# Altium project Flashing LED Badge.PrjPcb
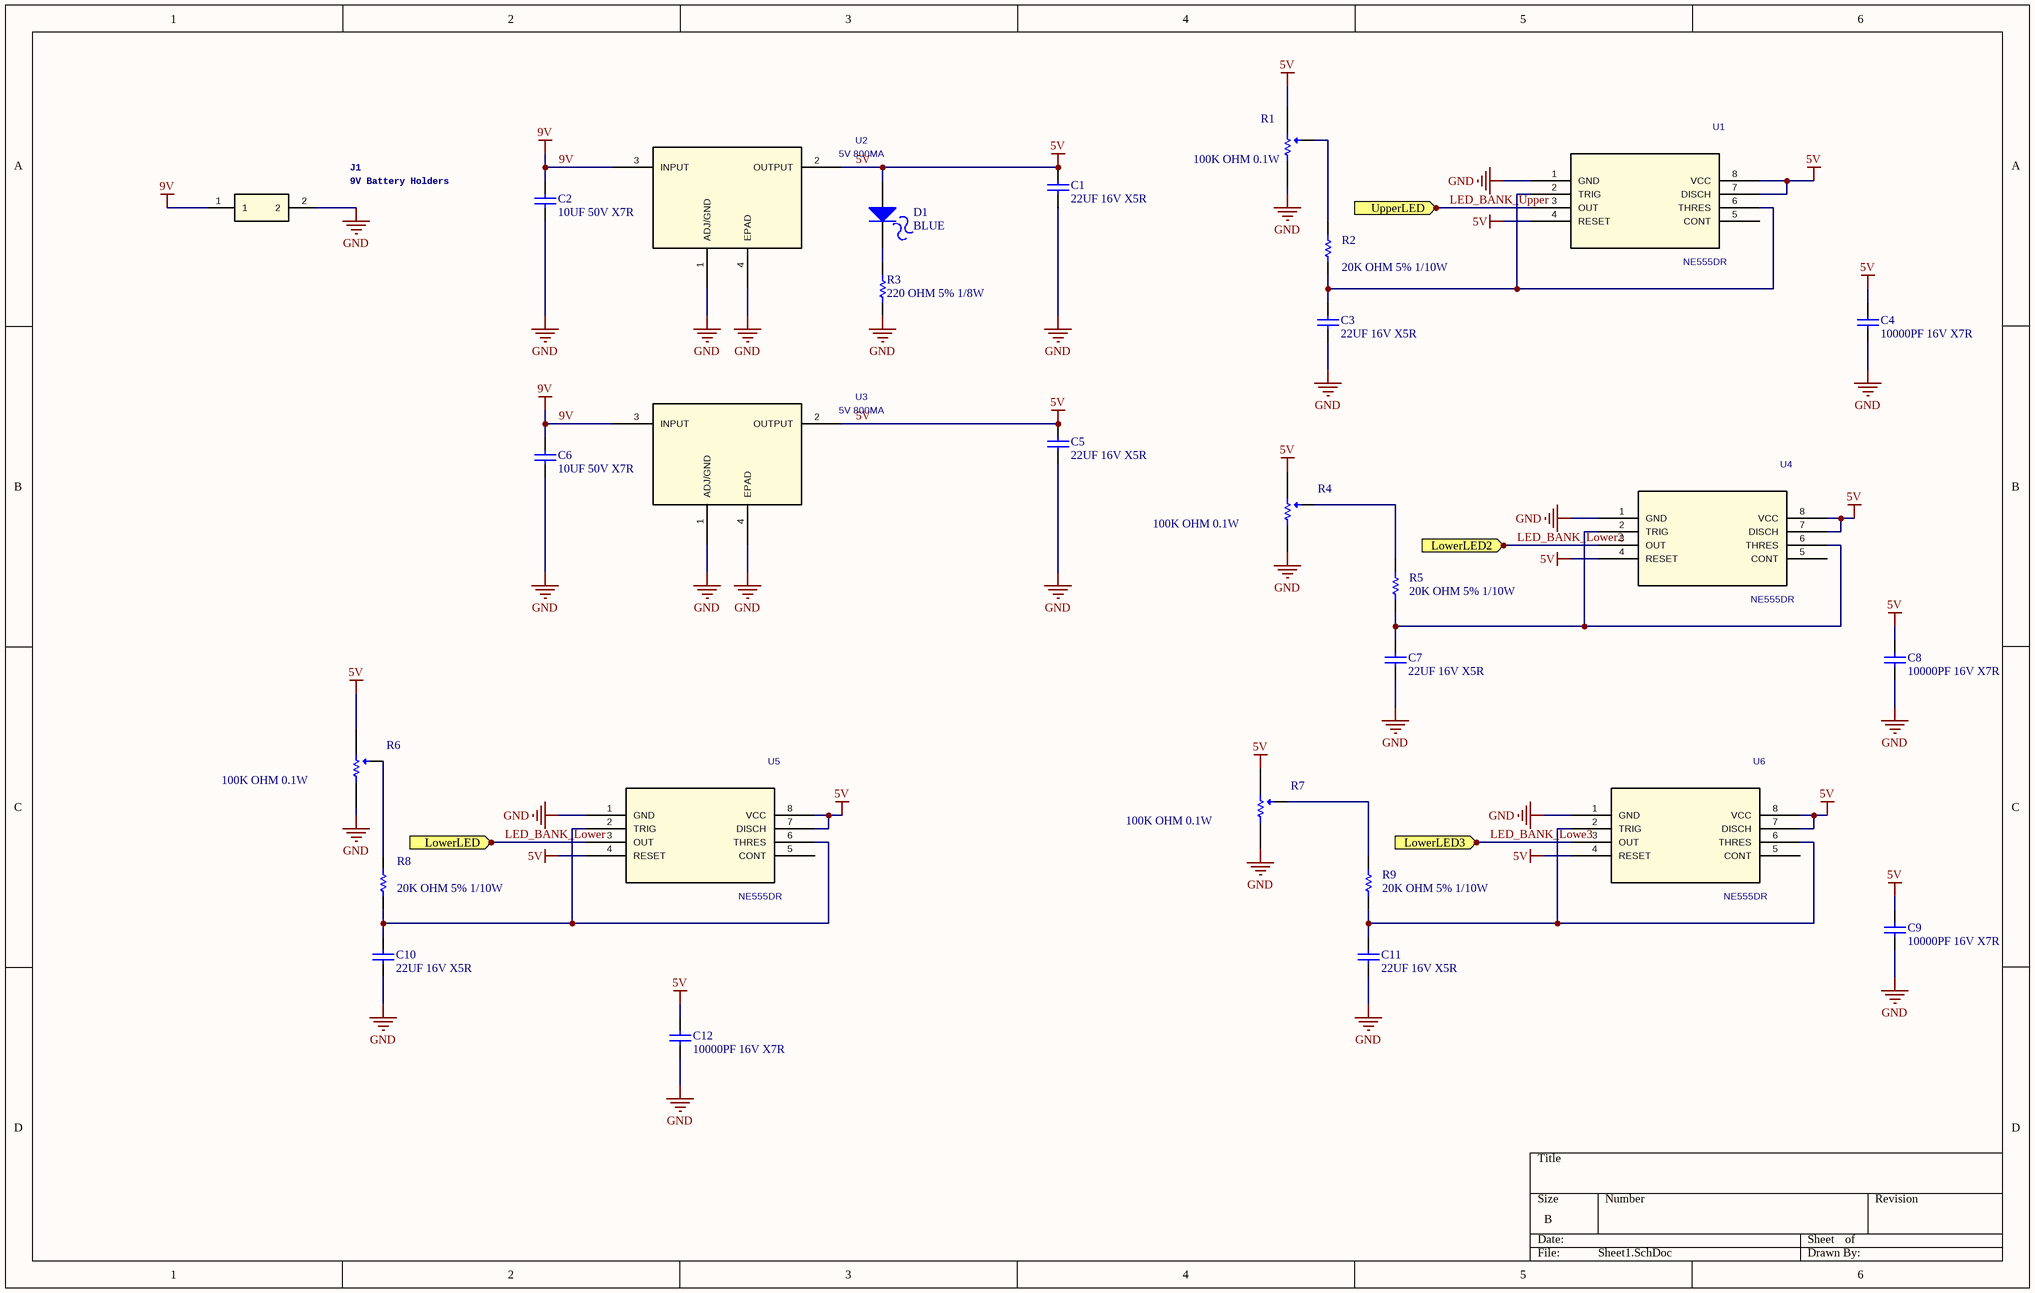
[diagram p0: Sheet1.SchDoc]
2 sheets, 101 parts. Net scope: flat (ports and power ports of the same name join across sheets).
Sheets:
  Sheet1.SchDoc
  Sheet2.SchDoc

## Sheet Sheet1.SchDoc
size B

### Parts
C1  22UF 16V X5R  [SMD-0805C]
C2  10UF 50V X7R  [2220 cap]
C3  22UF 16V X5R  [SMD-0805C]
C4  10000PF 16V X7R  [SMD-0603C]
C5  22UF 16V X5R  [SMD-0805C]
C6  10UF 50V X7R  [2220 cap]
C7  22UF 16V X5R  [SMD-0805C]
C8  10000PF 16V X7R  [SMD-0603C]
C9  10000PF 16V X7R  [SMD-0603C]
C10  22UF 16V X5R  [SMD-0805C]
C11  22UF 16V X5R  [SMD-0805C]
C12  10000PF 16V X7R  [SMD-0603C]
D1  BLUE  [0603 LED BLUE]
J1  9V Battery Holders  [1294]
R1  100K OHM 0.1W  [3.80mm x 3.60mm x 1.20mm POT]
R2  20K OHM 5% 1/10W  [SMD-0603-RES]
R3  220 OHM 5% 1/8W  [SMD-0805-RES]
R4  100K OHM 0.1W  [3.80mm x 3.60mm x 1.20mm POT]
R5  20K OHM 5% 1/10W  [SMD-0603-RES]
R6  100K OHM 0.1W  [3.80mm x 3.60mm x 1.20mm POT]
R7  100K OHM 0.1W  [3.80mm x 3.60mm x 1.20mm POT]
R8  20K OHM 5% 1/10W  [SMD-0603-RES]
R9  20K OHM 5% 1/10W  [SMD-0603-RES]
U1  NE555DR  [SOIC 8 TI]
U2  5V 800MA  [SOT-223]
U3  5V 800MA  [SOT-223]
U4  NE555DR  [SOIC 8 TI]
U5  NE555DR  [SOIC 8 TI]
U6  NE555DR  [SOIC 8 TI]

### Ports
LowerLED, LowerLED2, LowerLED3, UpperLED

### Nets
5V: C1.2 C4.2 C5.2 C8.2 C9.2 C12.2 D1.1(Anode) R1.3 R4.3 R6.3 R7.3 U1.4(RESET) U1.7(DISCH) U1.8(VCC) U2.2(OUTPUT) U3.2(OUTPUT) U4.4(RESET) U4.7(DISCH) U4.8(VCC) U5.4(RESET) U5.7(DISCH) U5.8(VCC) U6.4(RESET) U6.7(DISCH) U6.8(VCC)
9V: C2.2 C6.2 J1.1 U2.3(INPUT) U3.3(INPUT)
GND: C1.1 C2.1 C3.1 C4.1 C5.1 C6.1 C7.1 C8.1 C9.1 C10.1 C11.1 C12.1 J1.2 R1.1 R3.1 R4.1 R6.1 R7.1 U1.1(GND) U2.1(ADJ/GND) U2.4(EPAD) U3.1(ADJ/GND) U3.4(EPAD) U4.1(GND) U5.1(GND) U6.1(GND)
LED_BANK_Lowe3: U6.3(OUT) ; port LowerLED3
LED_BANK_Lower: U5.3(OUT) ; port LowerLED
LED_BANK_Lower2: U4.3(OUT) ; port LowerLED2
LED_BANK_Upper: U1.3(OUT) ; port UpperLED
NetC3_2: C3.2 R2.1 U1.2(TRIG) U1.6(THRES)
NetC7_2: C7.2 R5.1 U4.2(TRIG) U4.6(THRES)
NetC10_2: C10.2 R8.1 U5.2(TRIG) U5.6(THRES)
NetC11_2: C11.2 R9.1 U6.2(TRIG) U6.6(THRES)
NetD1_2: D1.2(Cathode) R3.2
NetR1_2: R1.2 R2.2
NetR4_2: R4.2 R5.2
NetR6_2: R6.2 R8.2
NetR7_2: R7.2 R9.2

Not connected (* = marked no-connect by the designer): U1 5(CONT); U4 5(CONT); U5 5(CONT); U6 5(CONT)

### Library data of the parts
C1 C3 C5 C7 C10 C11 = CL21A226MOCLRNC: CAP CER 22UF 16V X5R 0805; Manufacturer: Samsung Electro-Mechanics; Number: CL21A226MOCLRNC
C2 C6 = CGA9N3X7R1H106K230KB: CAP CER 10UF 50V X7R 2220; Manufacturer: TDK Corporation; Number: CGA9N3X7R1H106K230KB
C4 C8 C9 C12 = C0603C103K4RACTU: CAP CER 10000PF 16V X7R 0603; Manufacturer: KEMET; Number: C0603C103K4RACTU
D1 = LTST-C190TBKT: LED BLUE CLEAR CHIP SMD; Manufacturer: Lite-On Inc.; Number: LTST-C190TBKT
J1 = 1294: BATTERY HOLDER 9V PC PIN; Manufacturer: Keystone Electronics; Number: 1294
R1 R4 R6 R7 = TC33X-2-104E: TRIMMER 100K OHM 0.1W J LEAD TOP; Manufacturer: TT Electronics/BI; Number: TC33X-2-104E
R2 R5 R8 R9 = RC0603JR-0720KL: RES SMD 20K OHM 5% 1/10W 0603; Manufacturer: Yageo; Number: RC0603JR-0720KL
R3 = RC0805JR-07220RL: RES SMD 220 OHM 5% 1/8W 0805; Manufacturer: Yageo; Number: RC0805JR-07220RL
U1 U4-U6 = NE555DR: IC OSC SGL TIMER 100KHZ 8-SOIC; Manufacturer: Texas Instruments; Number: NE555DR
U2 U3 = AZ1117CH-5.0TRG1: IC REG LINEAR 5V 800MA SOT223; Manufacturer: Diodes Incorporated; Number: AZ1117CH-3.3TRG1

## Sheet Sheet2.SchDoc
size B
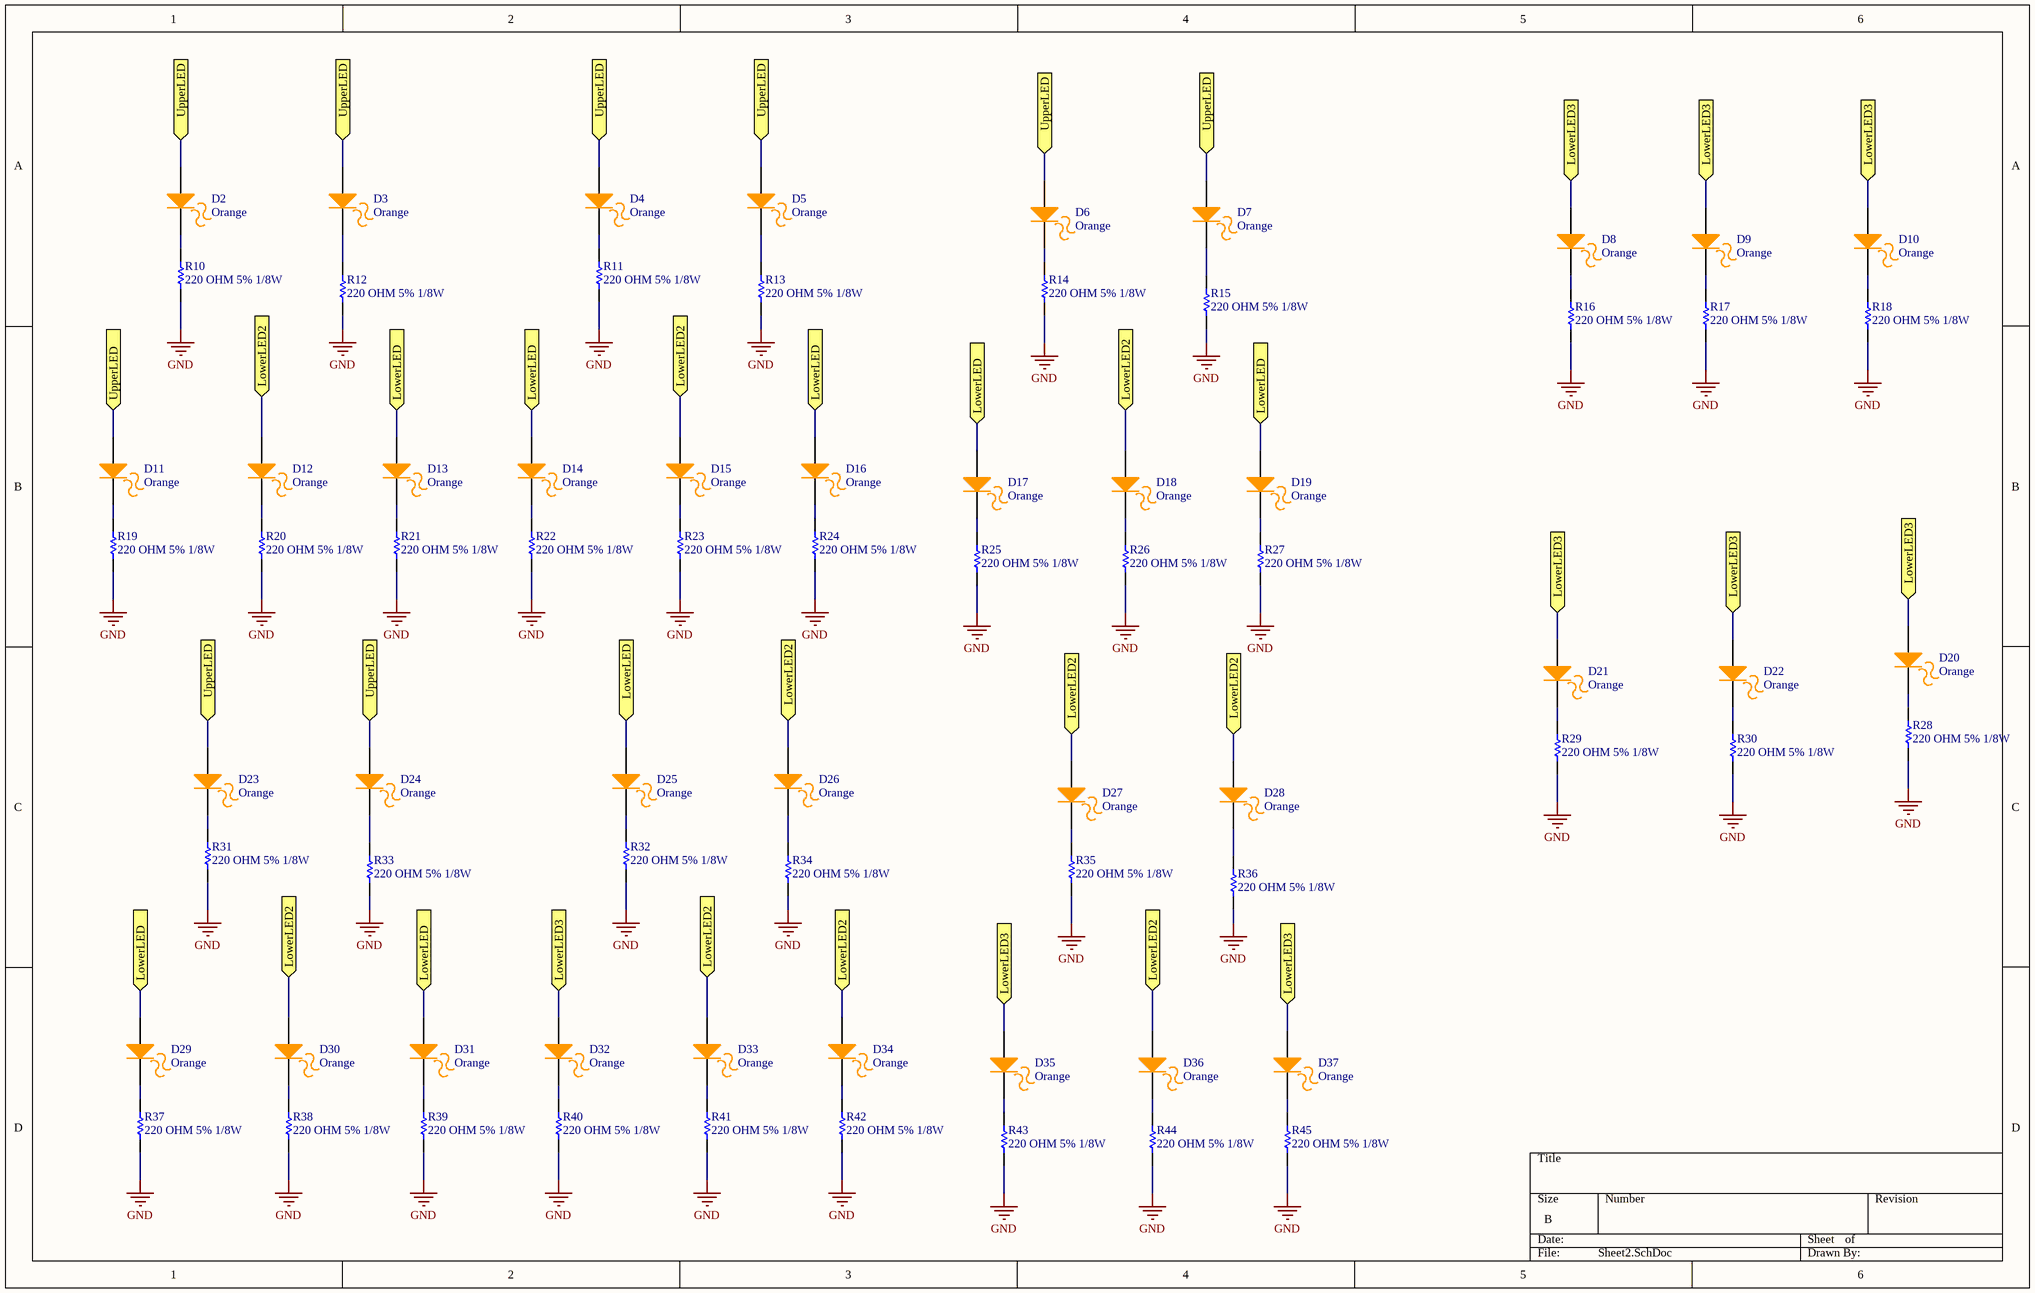
[diagram p1: Sheet2.SchDoc]

### Parts
D2  Orange  [0603 LED Green]
D3  Orange  [0603 LED Green]
D4  Orange  [0603 LED Green]
D5  Orange  [0603 LED Green]
D6  Orange  [0603 LED Green]
D7  Orange  [0603 LED Green]
D8  Orange  [0603 LED Green]
D9  Orange  [0603 LED Green]
D10  Orange  [0603 LED Green]
D11  Orange  [0603 LED Green]
D12  Orange  [0603 LED Green]
D13  Orange  [0603 LED Green]
D14  Orange  [0603 LED Green]
D15  Orange  [0603 LED Green]
D16  Orange  [0603 LED Green]
D17  Orange  [0603 LED Green]
D18  Orange  [0603 LED Green]
D19  Orange  [0603 LED Green]
D20  Orange  [0603 LED Green]
D21  Orange  [0603 LED Green]
D22  Orange  [0603 LED Green]
D23  Orange  [0603 LED Green]
D24  Orange  [0603 LED Green]
D25  Orange  [0603 LED Green]
D26  Orange  [0603 LED Green]
D27  Orange  [0603 LED Green]
D28  Orange  [0603 LED Green]
D29  Orange  [0603 LED Green]
D30  Orange  [0603 LED Green]
D31  Orange  [0603 LED Green]
D32  Orange  [0603 LED Green]
D33  Orange  [0603 LED Green]
D34  Orange  [0603 LED Green]
D35  Orange  [0603 LED Green]
D36  Orange  [0603 LED Green]
D37  Orange  [0603 LED Green]
R10  220 OHM 5% 1/8W  [SMD-0805-RES]
R11  220 OHM 5% 1/8W  [SMD-0805-RES]
R12  220 OHM 5% 1/8W  [SMD-0805-RES]
R13  220 OHM 5% 1/8W  [SMD-0805-RES]
R14  220 OHM 5% 1/8W  [SMD-0805-RES]
R15  220 OHM 5% 1/8W  [SMD-0805-RES]
R16  220 OHM 5% 1/8W  [SMD-0805-RES]
R17  220 OHM 5% 1/8W  [SMD-0805-RES]
R18  220 OHM 5% 1/8W  [SMD-0805-RES]
R19  220 OHM 5% 1/8W  [SMD-0805-RES]
R20  220 OHM 5% 1/8W  [SMD-0805-RES]
R21  220 OHM 5% 1/8W  [SMD-0805-RES]
R22  220 OHM 5% 1/8W  [SMD-0805-RES]
R23  220 OHM 5% 1/8W  [SMD-0805-RES]
R24  220 OHM 5% 1/8W  [SMD-0805-RES]
R25  220 OHM 5% 1/8W  [SMD-0805-RES]
R26  220 OHM 5% 1/8W  [SMD-0805-RES]
R27  220 OHM 5% 1/8W  [SMD-0805-RES]
R28  220 OHM 5% 1/8W  [SMD-0805-RES]
R29  220 OHM 5% 1/8W  [SMD-0805-RES]
R30  220 OHM 5% 1/8W  [SMD-0805-RES]
R31  220 OHM 5% 1/8W  [SMD-0805-RES]
R32  220 OHM 5% 1/8W  [SMD-0805-RES]
R33  220 OHM 5% 1/8W  [SMD-0805-RES]
R34  220 OHM 5% 1/8W  [SMD-0805-RES]
R35  220 OHM 5% 1/8W  [SMD-0805-RES]
R36  220 OHM 5% 1/8W  [SMD-0805-RES]
R37  220 OHM 5% 1/8W  [SMD-0805-RES]
R38  220 OHM 5% 1/8W  [SMD-0805-RES]
R39  220 OHM 5% 1/8W  [SMD-0805-RES]
R40  220 OHM 5% 1/8W  [SMD-0805-RES]
R41  220 OHM 5% 1/8W  [SMD-0805-RES]
R42  220 OHM 5% 1/8W  [SMD-0805-RES]
R43  220 OHM 5% 1/8W  [SMD-0805-RES]
R44  220 OHM 5% 1/8W  [SMD-0805-RES]
R45  220 OHM 5% 1/8W  [SMD-0805-RES]

### Ports
LowerLED, LowerLED2, LowerLED3, UpperLED

### Nets
GND: R10.1 R11.1 R12.1 R13.1 R14.1 R15.1 R16.1 R17.1 R18.1 R19.1 R20.1 R21.1 R22.1 R23.1 R24.1 R25.1 R26.1 R27.1 R28.1 R29.1 R30.1 R31.1 R32.1 R33.1 R34.1 R35.1 R36.1 R37.1 R38.1 R39.1 R40.1 R41.1 R42.1 R43.1 R44.1 R45.1
LED_BANK_Lowe3: D8.1(Anode) D9.1(Anode) D10.1(Anode) D20.1(Anode) D21.1(Anode) D22.1(Anode) D32.1(Anode) D35.1(Anode) D37.1(Anode) ; port LowerLED3
LED_BANK_Lower: D13.1(Anode) D14.1(Anode) D16.1(Anode) D17.1(Anode) D19.1(Anode) D25.1(Anode) D29.1(Anode) D31.1(Anode) ; port LowerLED
LED_BANK_Lower2: D12.1(Anode) D15.1(Anode) D18.1(Anode) D26.1(Anode) D27.1(Anode) D28.1(Anode) D30.1(Anode) D33.1(Anode) D34.1(Anode) D36.1(Anode) ; port LowerLED2
LED_BANK_Upper: D2.1(Anode) D3.1(Anode) D4.1(Anode) D5.1(Anode) D6.1(Anode) D7.1(Anode) D11.1(Anode) D23.1(Anode) D24.1(Anode) ; port UpperLED
NetD2_2: D2.2(Cathode) R10.2
NetD3_2: D3.2(Cathode) R12.2
NetD4_2: D4.2(Cathode) R11.2
NetD5_2: D5.2(Cathode) R13.2
NetD6_2: D6.2(Cathode) R14.2
NetD7_2: D7.2(Cathode) R15.2
NetD8_2: D8.2(Cathode) R16.2
NetD9_2: D9.2(Cathode) R17.2
NetD10_2: D10.2(Cathode) R18.2
NetD11_2: D11.2(Cathode) R19.2
NetD12_2: D12.2(Cathode) R20.2
NetD13_2: D13.2(Cathode) R21.2
NetD14_2: D14.2(Cathode) R22.2
NetD15_2: D15.2(Cathode) R23.2
NetD16_2: D16.2(Cathode) R24.2
NetD17_2: D17.2(Cathode) R25.2
NetD18_2: D18.2(Cathode) R26.2
NetD19_2: D19.2(Cathode) R27.2
NetD20_2: D20.2(Cathode) R28.2
NetD21_2: D21.2(Cathode) R29.2
NetD22_2: D22.2(Cathode) R30.2
NetD23_2: D23.2(Cathode) R31.2
NetD24_2: D24.2(Cathode) R33.2
NetD25_2: D25.2(Cathode) R32.2
NetD26_2: D26.2(Cathode) R34.2
NetD27_2: D27.2(Cathode) R35.2
NetD28_2: D28.2(Cathode) R36.2
NetD29_2: D29.2(Cathode) R37.2
NetD30_2: D30.2(Cathode) R38.2
NetD31_2: D31.2(Cathode) R39.2
NetD32_2: D32.2(Cathode) R40.2
NetD33_2: D33.2(Cathode) R41.2
NetD34_2: D34.2(Cathode) R42.2
NetD35_2: D35.2(Cathode) R43.2
NetD36_2: D36.2(Cathode) R44.2
NetD37_2: D37.2(Cathode) R45.2

### Library data of the parts
D2-D37 = LTST-C191KFKT: LED ORANGE CLEAR SMD; Manufacturer: Lite-On Inc.; Number: LTST-C191KFKT
R10-R45 = RC0805JR-07220RL: as R3 on sheet Sheet1; Number: RC0805JR-07220RL

## Nets that join several sheets
GND: Sheet1 (26 pins), Sheet2 (36 pins)
LED_BANK_Lowe3: Sheet1 (U6.3), Sheet2 (9 pins)
LED_BANK_Lower: Sheet1 (U5.3), Sheet2 (8 pins)
LED_BANK_Lower2: Sheet1 (U4.3), Sheet2 (10 pins)
LED_BANK_Upper: Sheet1 (U1.3), Sheet2 (9 pins)